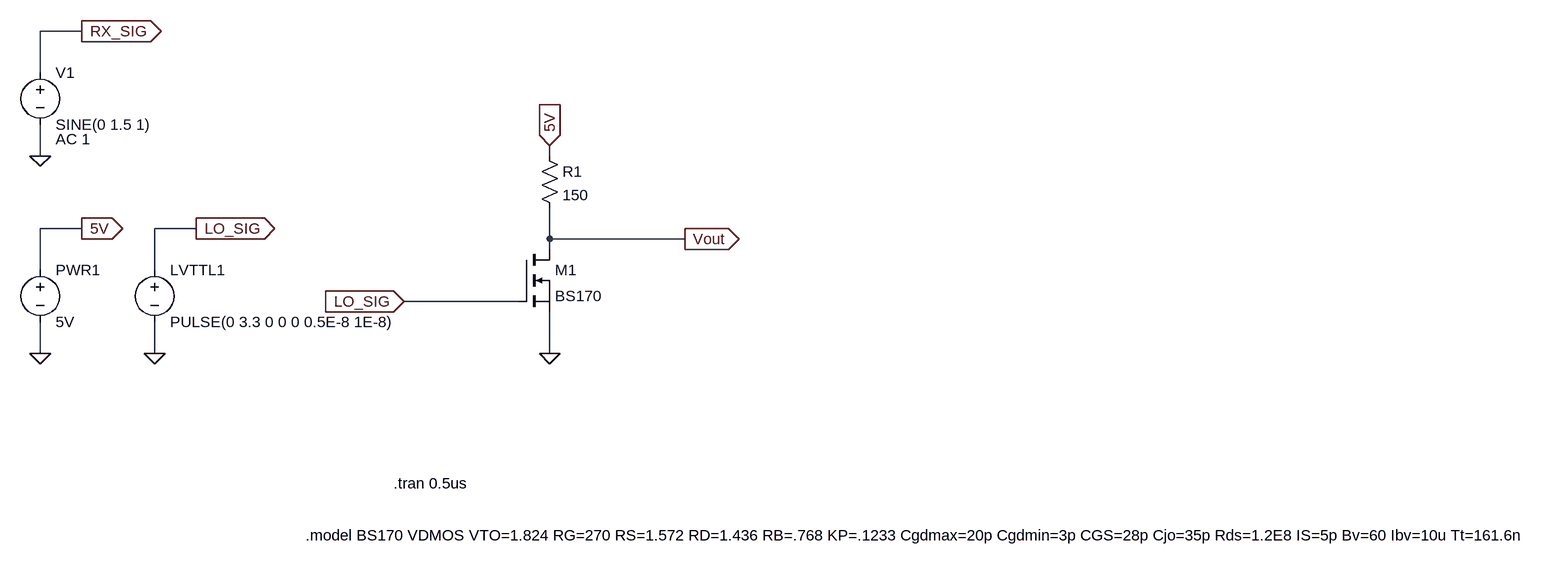
[diagram p0: schematic Draft1.asc]
Draft1.asc, the LTspice schematic file:
Version 4
SHEET 1 880 760
WIRE -1360 -32 -1424 -32
WIRE -1424 32 -1424 -32
WIRE -1424 160 -1424 112
WIRE -640 160 -640 144
WIRE -1360 272 -1424 272
WIRE -1184 272 -1248 272
WIRE -640 288 -640 240
WIRE -432 288 -640 288
WIRE -640 304 -640 288
WIRE -1424 336 -1424 272
WIRE -1248 336 -1248 272
WIRE -688 384 -864 384
WIRE -1424 464 -1424 416
WIRE -1248 464 -1248 416
WIRE -640 464 -640 400
FLAG -1424 464 0
FLAG -1360 272 5V
IOPIN -1360 272 Out
FLAG -1248 464 0
FLAG -1184 272 LO_SIG
IOPIN -1184 272 Out
FLAG -864 384 LO_SIG
IOPIN -864 384 In
FLAG -640 144 5V
IOPIN -640 144 In
FLAG -432 288 Vout
IOPIN -432 288 Out
FLAG -640 464 0
FLAG -1424 160 0
FLAG -1360 -32 RX_SIG
IOPIN -1360 -32 Out
SYMBOL Voltage -1424 320 R0
SYMATTR InstName PWR1
SYMATTR Value 5V
SYMBOL Voltage -1248 320 R0
SYMATTR InstName LVTTL1
SYMATTR Value PULSE(0 3.3 0 0 0 0.5E-8 1E-8)
SYMBOL Res -656 144 R0
SYMATTR InstName R1
SYMATTR Value 150
SYMBOL nmos -688 304 R0
SYMATTR InstName M1
SYMATTR Value BS170
SYMBOL Voltage -1424 16 R0
WINDOW 123 24 118 Left 2
SYMATTR Value2 AC 1
SYMATTR InstName V1
SYMATTR Value SINE(0 1.5 1)
TEXT -1016 744 Left 2 !.model BS170 VDMOS VTO=1.824 RG=270 RS=1.572 RD=1.436 RB=.768 KP=.1233 Cgdmax=20p Cgdmin=3p CGS=28p Cjo=35p Rds=1.2E8 IS=5p Bv=60 Ibv=10u Tt=161.6n
TEXT -880 664 Left 2 !.tran 0.5us

The netlist it stands for:
* Draft1.asc
V§PWR1 5V 0 5V
V§LVTTL1 LO_SIG 0 PULSE(0 3.3 0 0 0 0.5E-8 1E-8)
R1 5V Vout 150
M1 Vout LO_SIG 0 0 BS170
V1 RX_SIG 0 SINE(0 1.5 1) AC 1
.model NMOS NMOS
.model PMOS PMOS
.lib standard.mos
.model BS170 VDMOS VTO=1.824 RG=270 RS=1.572 RD=1.436 RB=.768 KP=.1233 Cgdmax=20p Cgdmin=3p CGS=28p Cjo=35p Rds=1.2E8 IS=5p Bv=60 Ibv=10u Tt=161.6n
.tran 0.5us
.backanno
.end